# Altium schematic sheet 003_HW1_Motor_Controller_Schematic.SchDoc
size A; SheetNumber: 1; SheetTotal: 1
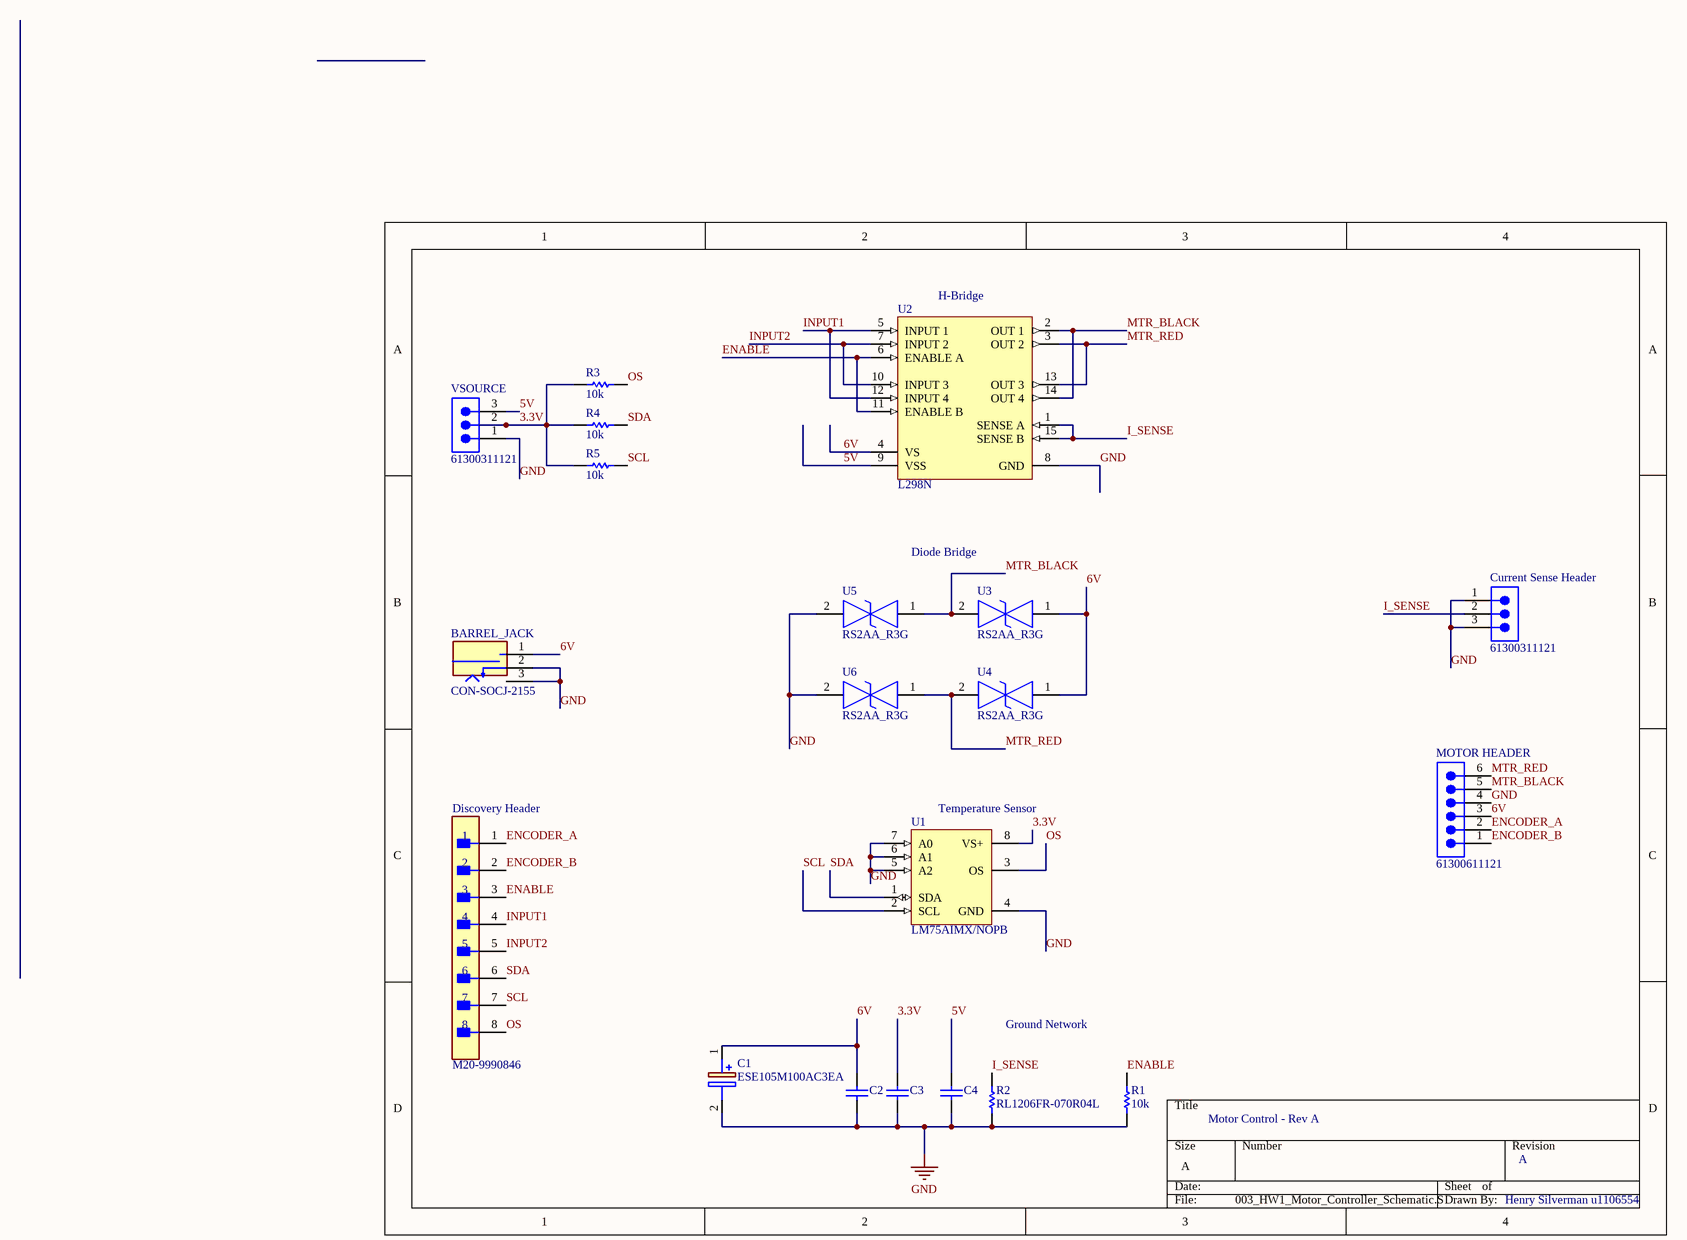
[diagram p0: 003_HW1_Motor_Controller_Schematic.SchDoc]

## Parts
BARREL_JACK  CON-SOCJ-2155  [GRAVITECH_CON-SOCJ-2155]
C1  ESE105M100AC3EA  [ESE105M100AC3EA]
C2  C1206C104K5RACTU  [KEMT-1206-2_M]  (value not drawn)
C3  C1206C104K5RACTU  [KEMT-1206-2_M]  (value not drawn)
C4  C1206C104K5RACTU  [KEMT-1206-2_M]  (value not drawn)
Current_Sense_Header  61300311121  [61300311121]
Discovery_Header  M20-9990846  [FP-M20-9990846-MFG]
MOTOR_HEADER  61300611121  [61300611121]
R1  value 10k  [RESC3216X60X45ML15T20]  (hidden comment: Resistor 0R +/- 5% 1206 250 mW)
R2  RL1206FR-070R04L  [RESC3116X65X40ML10T20]
R3  value 10k  [RESC3216X60X45ML15T20]  (hidden comment: Resistor 0R +/- 5% 1206 250 mW)
R4  value 10k  [RESC3216X60X45ML15T20]  (hidden comment: Resistor 0R +/- 5% 1206 250 mW)
R5  value 10k  [RESC3216X60X45ML15T20]  (hidden comment: Resistor 0R +/- 5% 1206 250 mW)
U1  LM75AIMX/NOPB  [D0008A_M]
U2  L298N  [STM-FM-15]
U3  RS2AA_R3G  [DIONM5126X250N]
U4  RS2AA_R3G  [DIONM5126X250N]
U5  RS2AA_R3G  [DIONM5126X250N]
U6  RS2AA_R3G  [DIONM5126X250N]
VSOURCE  61300311121  [61300311121]

## Nets
GND: BARREL_JACK.2 BARREL_JACK.3 C1.2(-) C2.1 C3.1 C4.1 Current_Sense_Header.1 Current_Sense_Header.3 MOTOR_HEADER.4 R1.2 R2.1 U1.4(GND) U1.5(A2) U1.6(A1) U1.7(A0) U2.8(GND) U5.2 U6.2 VSOURCE.1
3.3V: C3.2 R3.1 R4.1 R5.1 U1.8(VS+) VSOURCE.2
5V: C4.2 U2.9(VSS) VSOURCE.3
6V: BARREL_JACK.1 C1.1(+) C2.2 MOTOR_HEADER.3 U2.4(VS) U3.1 U4.1
ENABLE: Discovery_Header.3 R1.1 U2.6(ENABLE_A) U2.11(ENABLE_B)
ENCODER_A: Discovery_Header.1 MOTOR_HEADER.2
ENCODER_B: Discovery_Header.2 MOTOR_HEADER.1
I_SENSE: Current_Sense_Header.2 R2.2 U2.1(SENSE_A) U2.15(SENSE_B)
INPUT1: Discovery_Header.4 U2.5(INPUT_1) U2.12(INPUT_4)
INPUT2: Discovery_Header.5 U2.7(INPUT_2) U2.10(INPUT_3)
MTR_BLACK: MOTOR_HEADER.5 U2.2(OUT_1) U2.14(OUT_4) U3.2 U5.1
MTR_RED: MOTOR_HEADER.6 U2.3(OUT_2) U2.13(OUT_3) U4.2 U6.1
OS: Discovery_Header.8 R3.2 U1.3(OS)
SCL: Discovery_Header.7 R5.2 U1.2(SCL)
SDA: Discovery_Header.6 R4.2 U1.1(SDA)

## Notes on the sheet
- (near U2) H-Bridge
- Diode Bridge
- (near U1) Temperature Sensor
- Ground Network
- Motor Control - Rev A
- A
- Henry Silverman u1106554

## Library data of the parts
BARREL_JACK = CMP-002-00071-1: DC Power Connectors Power Jack/Connector 2.1mm x 5.5mm; MF: Gravitech; Component Type: Standard; SnapEDA_Link: https://www.snapeda.com/parts/CON-SOCJ-2155/Gravitech/view-part/?ref=snap; Value: *; Case/Package: None; Pins: 3; Check_prices: https://www.snapeda.com/parts/CON-SOCJ-2155/Gravitech/view-part/?ref=eda; MP: CON-SOCJ-2155; Price: None; Design Item ID: CON-SOCJ-2155; Source: CON-SOCJ-2155.SchLib; Availability: In Stock
C1 = ESE105M100AC3EA: Capacitor Polarised; Manufacturer_Name: KEMET; Datasheet Link: https://content.kemet.com/datasheets/KEM_A4055_ESE.pdf; Height: 12.5mm; Manufacturer_Part_Number: ESE105M100AC3EA; Mouser Part Number: 80-ESE105M100AC3EA; Mouser Price/Stock: https://www.mouser.co.uk/ProductDetail/KEMET/ESE105M100AC3EA?qs=9RUIYXQlAdClzKJAOQ1XXg%3D%3D
C2-C4 = CMP-1037-04202-2: CAP, Ceramic, 0.1 uF, +/- 10%, 50 V, -55 to 125 degC, 1206 (3216 Metric), RoHS, Tape and Reel; Manufacturer: Kemet; Voltage Rating: 50V; Capacitance: 0.1µF; Product Range: KEMET-CSeries; SVHC: ToBeAdvised; Dielectric Characteristic: X7R; Capacitor Case Style: 1206[3216Metric]; Package Reference: 1206-2; Package Description: 2-Leads SMD, Body 3.2 x 1.6 mm; Packaging: Tape&Reel; Operating Temperature Max: 125degC; Capacitance Tolerance: ±10%; Datasheet URL: https://datasheet.ciiva.com/6125/1725438-6125494.pdf; Manufacturer URL: http://www.kemet.com/; Operating Temperature Min: -55degC; Datasheet Version: Jul-13
Current_Sense_Header VSOURCE = CMP-1502-01062-2: NexarPartId: 32855521; Voltage Rating: 250V; Current Rating: 3A; Connector Type: Male Pin; Number of Positions: 3; Gender: Male; Contact Resistance: 20mΩ; Pitch: 2.54mm; Max Operating Temperature: 105°C; Lead Pitch: 2.54mm; Lead Free: Lead Free; Contact Mating Length: 5.9944mm; Contact Material: Copper; Number of Pins: 3; Orientation: Vertical; Height: 8.94mm; Packaging: Bulk; Min Operating Temperature: -40°C; Mount: Through Hole; RoHS: Compliant; Number of Contacts: 3; Operating Supply Voltage: 250V; Termination: Solder; Number of Rows: 1; Contact Plating: Gold; Color: Black; REACH SVHC: Unknown
Discovery_Header = CMP-15831-000033-1: CONN HEADER VERT 8POS 2.54MM; Connector Type: Male Pin; Gender: Male; Insulation Resistance: 1GR; Number of Positions: 8; Contact Resistance: 30mR; Current Rating: 3A; Termination: Solder; Case/Package: SIL; RoHS Compliant: Yes; Series: M20; Housing Material: Nylon; Radiation Hardening: No; Package Quantity: 1000; Contact Material: Brass; Contact Plating: Tin; Max Operating Temperature: 105°C; Contact Mating Length: 0.24inch; Depth: 2.54mm; Color: Black; Number of Contacts: 8; Mount: Through Hole; Number of Rows: 1; Packaging: Bulk; Min Operating Temperature: -40°C; Max Current Rating: 3A; REACH SVHC: No SVHC; Pitch: 2.54mm; Housing Color: Black; Orientation: Straight; Length: 20.32mm; Contact Type: Male Pin
MOTOR_HEADER = CMP-1502-01070-2: NexarPartId: 20084590; Operating Supply Voltage: 250V; Current Rating: 3A; Number of Contacts: 6; Gender: Male; Connector Type: Male Pin; Pitch: 2.54mm; Contact Resistance: 20mΩ; Lead Free: Lead Free; REACH SVHC: Unknown; Number of Rows: 1; Color: Black; Min Operating Temperature: -40°C; Contact Material: Copper; Lead Pitch: 2.54mm; Contact Plating: Gold; Number of Pins: 6; Height: 8.89mm; Orientation: Vertical; Termination: Through Hole; Mount: Through Hole; RoHS: Compliant; Contact Gender: Male; Contact Mating Length: 5.9944mm; Voltage Rating: 250V; Number of Positions: 6; Housing Material: PBT; Packaging: Bulk; Max Operating Temperature: 105°C
R1 R3-R5 = CMP-009-00002-5: Chip Resistor, 0 Ohm, +/- 5%, 0.25 W, -55 to 155 degC, 1206 (3216 Metric); Voltage Rating: 200V; Power: 250mW; Tolerance: 5%; Min Operating Temperature: -55°C; Mounting Technology: SM; Max Operating Temperature: 155°C; Case/Package: 1206; RoHS Compliant: True; Pins: 2
R2 = CMP-2003-04065-1: Manufacturer: Yageo; Part Number: RL1206FR-070R04L
U1 = CMP-0066-00088-3: Digital Temperature Sensor and Thermal Watchdog with Two-Wire Interface, 8-pin Narrow SOIC, Pb-Free; Manufacturer: Texas Instruments; PowerWise: N; PackageTopMarking: NSZXTT*LM75*AIM; CompType: Temp Sensor IC; ComponentLink1URL: http://www.ti.com/general/docs/lit/getliterature.tsp?genericPartNumber=LM75A&fileType=pdf; Code_JEDEC: MS-012-AA; PackageReference: D0008A; ComponentLink1Description: Datasheet URL; RoHS: Y; PinCount: 8; Code_IPC: SOIC127P600-8; PackageDescription: SOIC Narrow, 4.9 x 3.9 x 1.45mm, 8 Lead, 1.27mm Pitch
U2 = CMP-2000-06526-1: Dual Full-Bridge Driver, 4.8 to 46 V, -40 to 150 degC, 15-Pin FM (MW 15L), RoHS, Tube; Manufacturer: STMicroelectronics; PartNumber: L298; Output Current: 2A; Supply Voltage Max: 7V; Driver Case Style: Multiwatt; Supply Voltage Min: 4.5V; No. of Pins: 15Pins; SVHC: NoSVHC(17-Dec-2015); Output Voltage: 46V; No. of Outputs: 4Outputs; Motor Type: FullBridge; MSL: -; Package Description: 15-Pin Flange Mount, Body 5 x 19.6 mm, Pitch 1.27 mm; Datasheet Version: 01/2000; Package Reference: FM-15; Mounting Technology: ThroughHole; Packaging: Each; Automotive Qualification Standard: -; Product Range: -; Datasheet URL: https://datasheet.ciiva.com/15109/getdatasheetpartid-50682-15109332.pdf; Operating Temperature Max: 130°C; Operating Temperature Min: -25°C; Manufacturer URL: http://www.st.com/
U3-U6 = RS2AA_R3G: TVS Diode (Bi-directional); Manufacturer_Name: Taiwan Semiconductor; Manufacturer_Part_Number: RS2AA R3G; Datasheet Link: https://datasheet.datasheetarchive.com/originals/distributors/DKDS-20/389261.pdf; Height: 2.5mm; Mouser Part Number: 821-RS2AAR3G; Mouser Price/Stock: https://www.mouser.co.uk/ProductDetail/Taiwan-Semiconductor/RS2AA-R3G?qs=Mv7BduZupUgh8QcFCREBiQ%3D%3D; Arrow Part Number: RS2AA R3G; Arrow Price/Stock: https://www.arrow.com/en/products/rs2aar3g/taiwan-semiconductor